# Altium project DM2097_R0M0E0.PrjPcb (part 4 of 4)
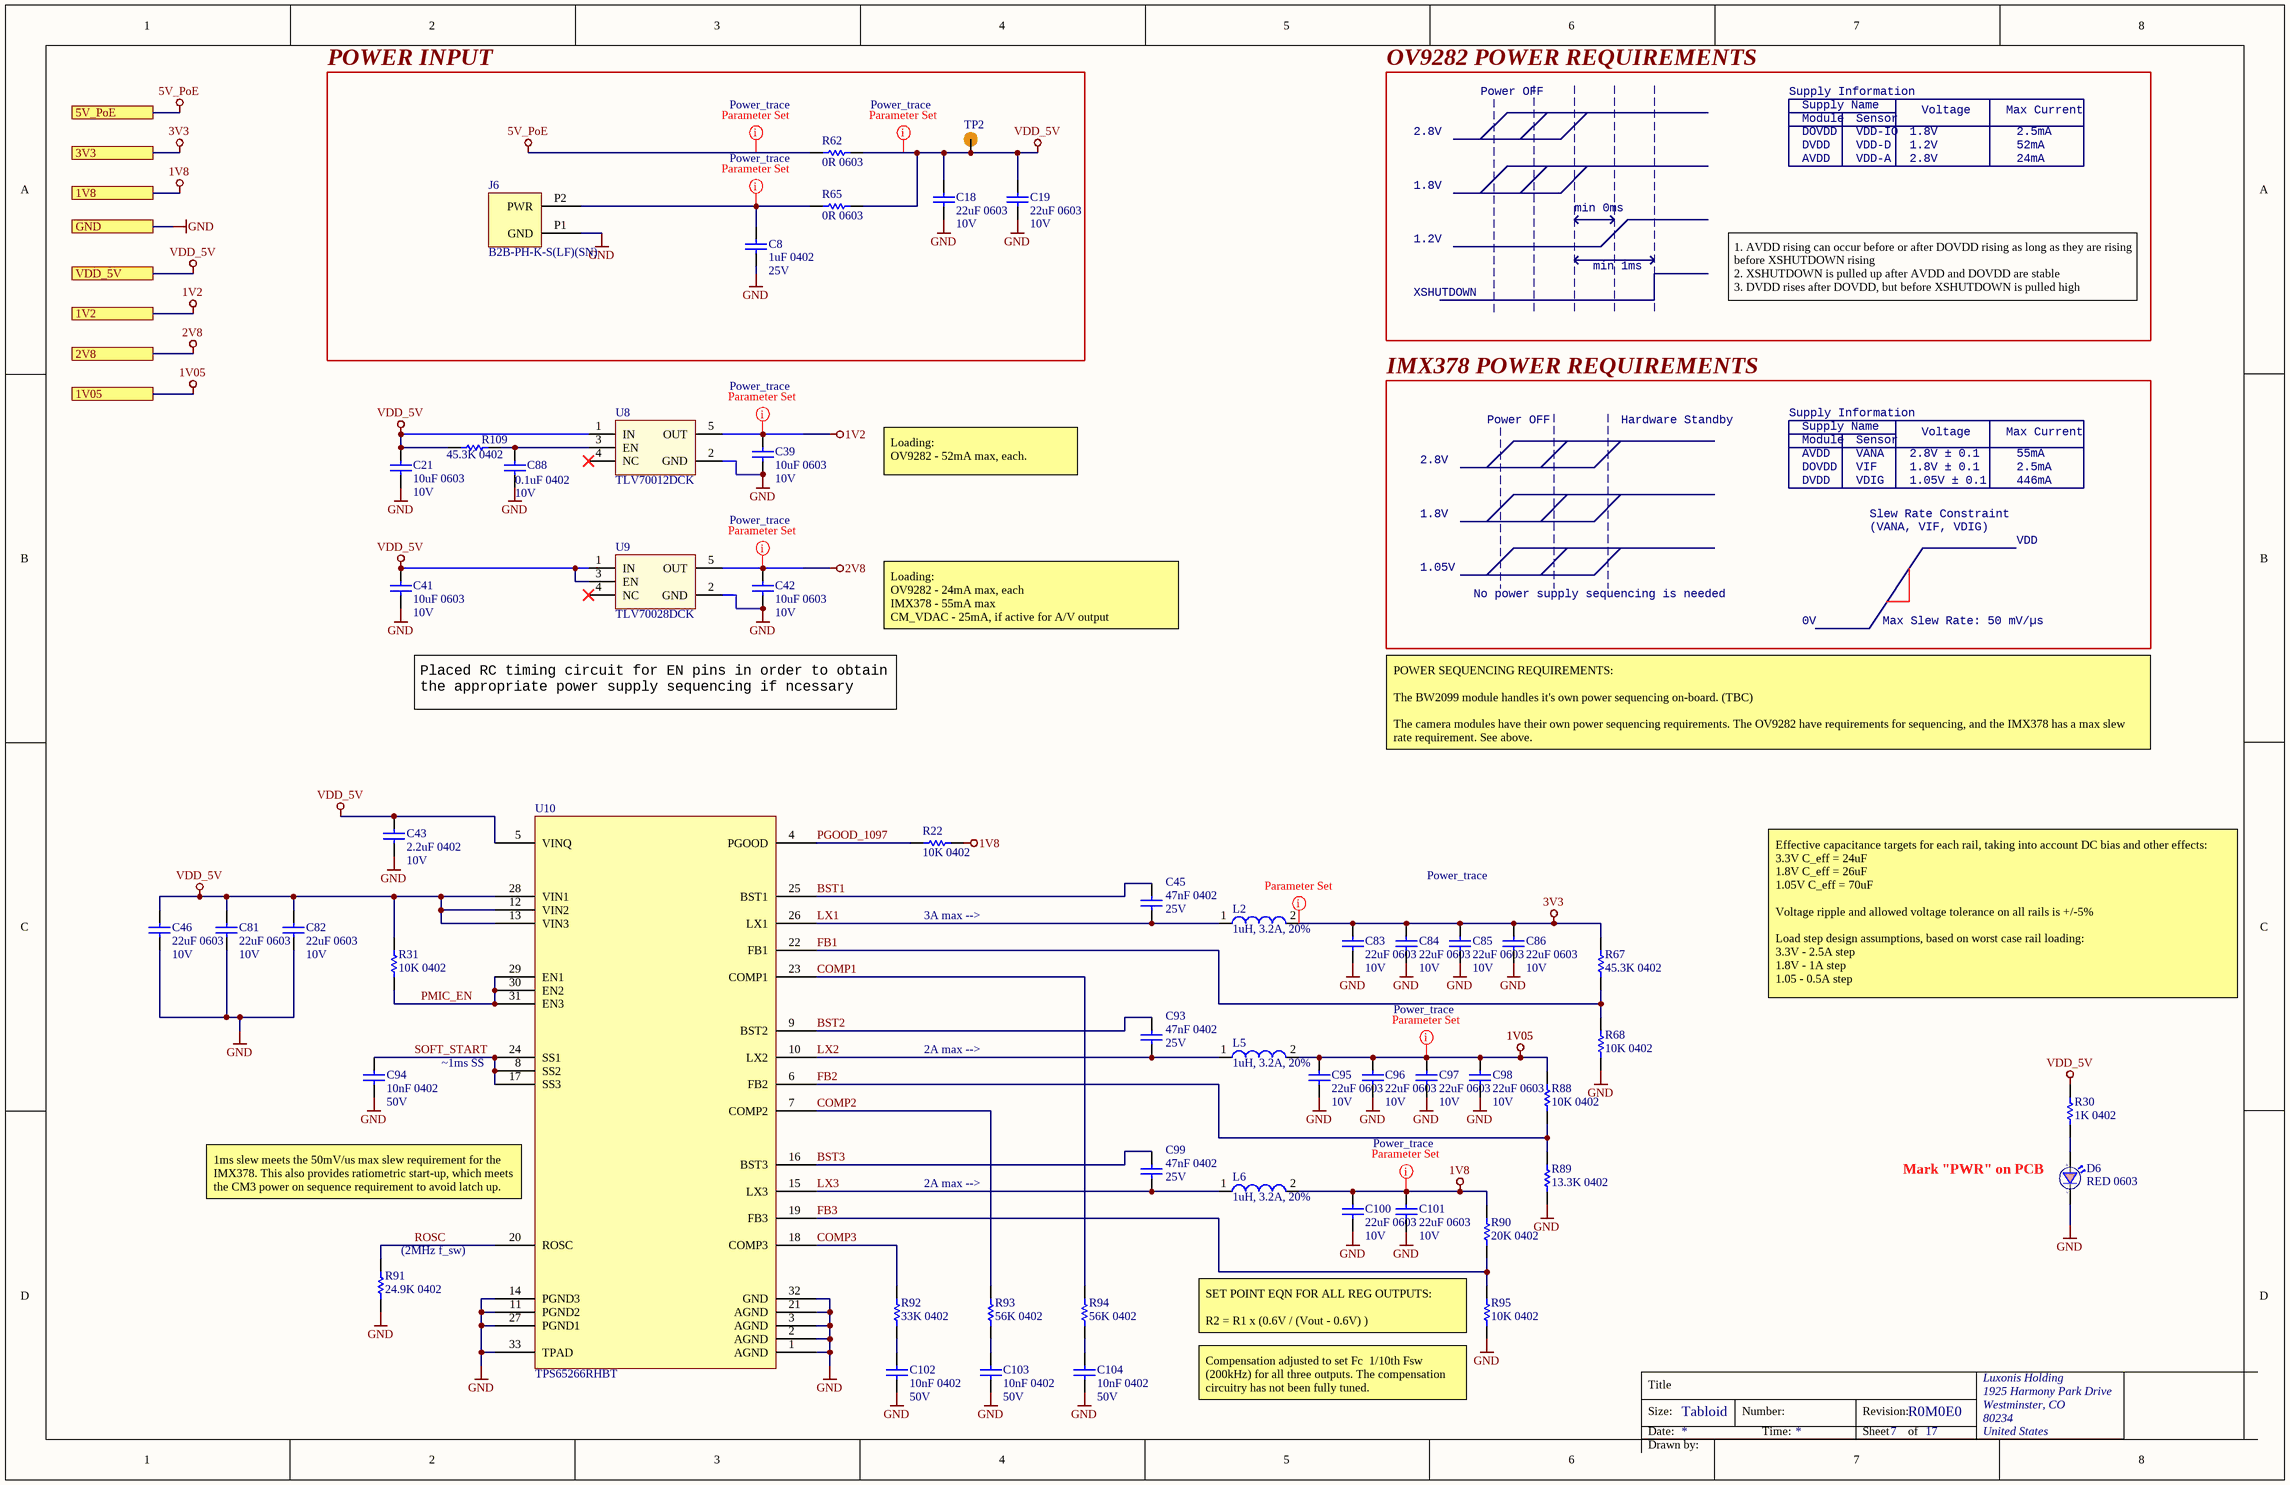
[diagram p9: DM2097_Power_Supply.SchDoc]

## Sheet DM2097_Power_Supply.SchDoc: =project_title (continued)

### Library data of the parts (continued)
U9 = TLV70028DCK: IC REG LINEAR 2.8V 200MA SC70-5 Linear Voltage Regulator IC  1 Output  200mA SC-70-5; Manufacturer 1: Texas Instruments; Manufacturer Part Number 1: TLV70028DCKT; Dropout Voltage: 175mV; Number of Outputs: 1; Max Power Dissipation: 320mW; Max Input Voltage: 5.5V; Min Input Voltage: 2V; Min Current Limit: 220mA; Polarity: Positive; Quiescent Current: 30uA; Accuracy: 2%; Output Type: Fixed; Nominal Supply Current: 31uA; Supplier 1: Digi-Key; Stock 1: 832; Pricing 1: 1=0.55000, 10=0.46700, 100=0.34900 (USD); RoHS: Yes; Case/Package: SC; Number of Pins: 5; Contact Plating: Gold; Min Operating Temperature: -40°C; Max Operating Temperature: 125°C; Package Quantity: 1; Packaging: Tape and Reel; Output Current: 200mA; Output Voltage: 2.8V; Max Output Current: 200mA; Number of Regulators: 1; Power Dissipation: 320mW; Min Output Voltage: 2.8V; Output Voltage Accuracy: 2%; Max Output Voltage: 2.8V; Max Supply Voltage: 5.5V; Min Supply Voltage: 2V; Nominal Output Voltage: 2.8V; Power Rating: 320mW; Termination: SMD/SMT; Length: 2.15mm; Height: 1mm; Width: 1.4mm; Radiation Hardening: No; Lead Free: Lead Free; REACH SVHC: No SVHC; ComponentLink1URL: https://datasheet.ciiva.com/14149/tlv700-eng-ds-14149840.pdf?src-supplier=Distrelec; ComponentLink1Description: https://datasheet.ciiva.com/14149/tlv700-eng-ds-14149840.pdf?src-supplier=Distrelec; ComponentLink2URL: https://datasheet.ciiva.com/22700/1882059-22700172.pdf?src-supplier=Element14; ComponentLink2Description: https://datasheet.ciiva.com/22700/1882059-22700172.pdf?src-supplier=Element14; Supplier 2: Digi-Key; Manufacturer 2: Texas Instruments; Manufacturer Part Number 2: TLV70028DCKR; Stock 2: 30013; Pricing 2: 1=0.48000, 10=0.40900, 100=0.30570, 500=0.24020, 1000=0.18561 (USD); ComponentLink3URL: http://components.arrow.com/part/dataview/0323_00585634?src-supplier=Arrow+Europe; ComponentLink3Description: http://components.arrow.com/part/dataview/0323_00585634?src-supplier=Arrow+Europe; ComponentLink4URL: http://focus.ti.com/lit/ds/symlink/tlv70033.pdf?src-supplier=Avnet+Europe; ComponentLink4Description: http://focus.ti.com/lit/ds/symlink/tlv70033.pdf?src-supplier=Avnet+Europe; ComponentLink5URL: http://www.ti.com/lit/ds/slvsa00d/slvsa00d.pdf?src-supplier=Digi-Key; ComponentLink5Description: http://www.ti.com/lit/ds/slvsa00d/slvsa00d.pdf?src-supplier=Digi-Key; ComponentLink6URL: http://www.ti.com/lit/pdf/slyy050?src-supplier=Digi-Key; ComponentLink6Description: http://www.ti.com/lit/pdf/slyy050?src-supplier=Digi-Key; ComponentLink7URL: http://www.ti.com/general/docs/lit/getliterature.tsp?genericPartNumber=TLV700&&fileType=pdf&src-supplier=Avnet+Asia; ComponentLink7Description: http://www.ti.com/general/docs/lit/getliterature.tsp?genericPartNumber=TLV700&&fileType=pdf&src-supplier=Avnet+Asia; ComponentLink8URL: http://www.ti.com/general/docs/lit/getliterature.tsp?genericPartNumber=TLV700&&fileType=pdf&src-supplier=Avnet; ComponentLink8Description: http://www.ti.com/general/docs/lit/getliterature.tsp?genericPartNumber=TLV700&&fileType=pdf&src-supplier=Avnet; ComponentLink9URL: http://components.arrow.com/part/dataview/48329233S8322732N7713?src-supplier=Arrow; ComponentLink9Description: http://components.arrow.com/part/dataview/48329233S8322732N7713?src-supplier=Arrow; ComponentLink10URL: http://www.ti.com/litv/slvsa00d?src-supplier=Mouser; ComponentLink10Description: http://www.ti.com/litv/slvsa00d?src-supplier=Mouser; ComponentLink11URL: http://www.ti.com/lit/ds/slvsa00e/slvsa00e.pdf?src-supplier=Digi-Key; ComponentLink11Description: http://www.ti.com/lit/ds/slvsa00e/slvsa00e.pdf?src-supplier=Digi-Key; Supplier Part Number 1: 296-39279-1-ND; Supplier Part Number 2: 296-25271-1-ND
U10 = TPS65266RHBT: 2.7V to 6.5V Input, 3A/2A/2A Triple Buck Converter 32-VQFN -40 to 85; Manufacturer 1: Texas Instruments; Output Current: 2A; Switching Frequency: 2.4MHz; Number of Outputs: 3; Min Output Voltage: 600mV; Synchronous Rectifier: Yes; Quiescent Current: 340uA; Output Type: Adjustable; Output Configuration: Positive; Current - Output 1: 3A; Manufacturer Part Number 1: TPS65266RHBT; Package: 32-VQFN; Supplier 1: Digi-Key; Stock 1: 4557; Pricing 1: 1=4.01000, 10=3.59900, 100=2.94850 (USD); RoHS: Yes; Mount: Surface Mount; Case/Package: VQFN; Number of Pins: 32; Weight: 0.002547oz; Min Operating Temperature: -40°C; Max Operating Temperature: 85°C; Packaging: Tape and Reel; Package Quantity: 250; Min Input Voltage: 2.7V; Max Input Voltage: 6.5V; Max Output Voltage: 6.5V; Operating Supply Voltage: 6.5V; Current - Output 2: 2A; Lead Free: Lead Free; REACH SVHC: No SVHC; ComponentLink1URL: http://www.ti.com/general/docs/lit/getliterature.tsp?genericPartNumber=TPS65266&&fileType=pdf&src-supplier=Element14; ComponentLink1Description: http://www.ti.com/general/docs/lit/getliterature.tsp?genericPartNumber=TPS65266&&fileType=pdf&src-supplier=Element14; ComponentLink2URL: http://www.ti.com/general/docs/lit/getliterature.tsp?genericPartNumber=TPS65266&amp;&amp;fileType=pdf&src-supplier=Farnell; ComponentLink2Description: http://www.ti.com/general/docs/lit/getliterature.tsp?genericPartNumber=TPS65266&amp;&amp;fileType=pdf&src-supplier=Farnell; ComponentLink3URL: http://www.ti.com/general/docs/lit/getliterature.tsp?genericPartNumber=TPS65266&&fileType=pdf&src-supplier=Farnell; ComponentLink3Description: http://www.ti.com/general/docs/lit/getliterature.tsp?genericPartNumber=TPS65266&&fileType=pdf&src-supplier=Farnell; ComponentLink4URL: http://www.ti.com/lit/ds/symlink/tps65266.pdf?src-supplier=Digi-Key; ComponentLink4Description: http://www.ti.com/lit/ds/symlink/tps65266.pdf?src-supplier=Digi-Key; ComponentLink5URL: http://www.ti.com/lit/gpn/tps65266?src-supplier=Mouser; ComponentLink5Description: http://www.ti.com/lit/gpn/tps65266?src-supplier=Mouser; ComponentLink6URL: http://www.ti.com/general/docs/lit/getliterature.tsp?genericPartNumber=TPS65266&&fileType=pdf&src-supplier=Avnet; ComponentLink6Description: http://www.ti.com/general/docs/lit/getliterature.tsp?genericPartNumber=TPS65266&&fileType=pdf&src-supplier=Avnet; Supplier Part Number 1: 296-38685-1-ND; Supplier 2: TI store; Supplier 3: Mouser; Supplier Part Number 2: TPS65266RHBT; Supplier Part Number 3: 595-TPS65266RHBT; Supplier 4: Mouser; Manufacturer Part Number 2: TPS65266RHBR; Category: Voltage Regulators - Switching; Stock 4: 5792; Pricing 4: 1=3,58000, 10=3,22000, 50=3,05000, 100=2,51000, 1000=1,80000, 10000=1,73000 (USD); Contact Plating: Gold; Length: 5mm; Width: 5mm; Height: 1mm; RoHS Compliant: Yes; ComponentLink7URL: http://www.ti.com/general/docs/suppproductinfo.tsp?distId=10&amp;gotoUrl=http%3A%2F%2Fwww.ti.com%2Flit%2Fgpn%2Ftps65266&src-supplier=Digi-Key; ComponentLink7Description: http://www.ti.com/general/docs/suppproductinfo.tsp?distId=10&amp;gotoUrl=http%3A%2F%2Fwww.ti.com%2Flit%2Fgpn%2Ftps65266&src-supplier=Digi-Key; ComponentLink8URL: http://www.ti.com/general/docs/lit/getliterature.tsp?genericPartNumber=TPS65266&&fileType=pdf&src-supplier=Avnet+Asia; ComponentLink8Description: http://www.ti.com/general/docs/lit/getliterature.tsp?genericPartNumber=TPS65266&&fileType=pdf&src-supplier=Avnet+Asia; Manufacturer 2: Texas Instruments; Supplier 5: Mouser; Manufacturer 3: Texas Instruments; Manufacturer Part Number 3: TPS65266-1RHBR; Stock 5: 2820; Pricing 5: 1=3,58000, 10=3,22000, 50=3,05000, 100=2,51000, 1000=1,80000, 10000=1,73000 (USD); ComponentLink9URL: http://www.ti.com/lit/ds/symlink/tps65266-1.pdf?src-supplier=Digi-Key; ComponentLink9Description: http://www.ti.com/lit/ds/symlink/tps65266-1.pdf?src-supplier=Digi-Key; Supplier Part Number 4: 595-TPS65266RHBR; Supplier Part Number 5: 595-TPS65266-1RHBR

## Sheet Project_Information.SchDoc: =project_title
size Tabloid; CompanyName: Luxonis Holding; DrawnBy: David Malovrh; Organization: Luxonis Holding; Address1: 1925 Harmony Park Drive; Address2: Westminster, CO; Address3: 80234; Address4: United States; DocumentNumber: D0000200; Revision: R0M0E0; SheetNumber: 1; SheetTotal: 17
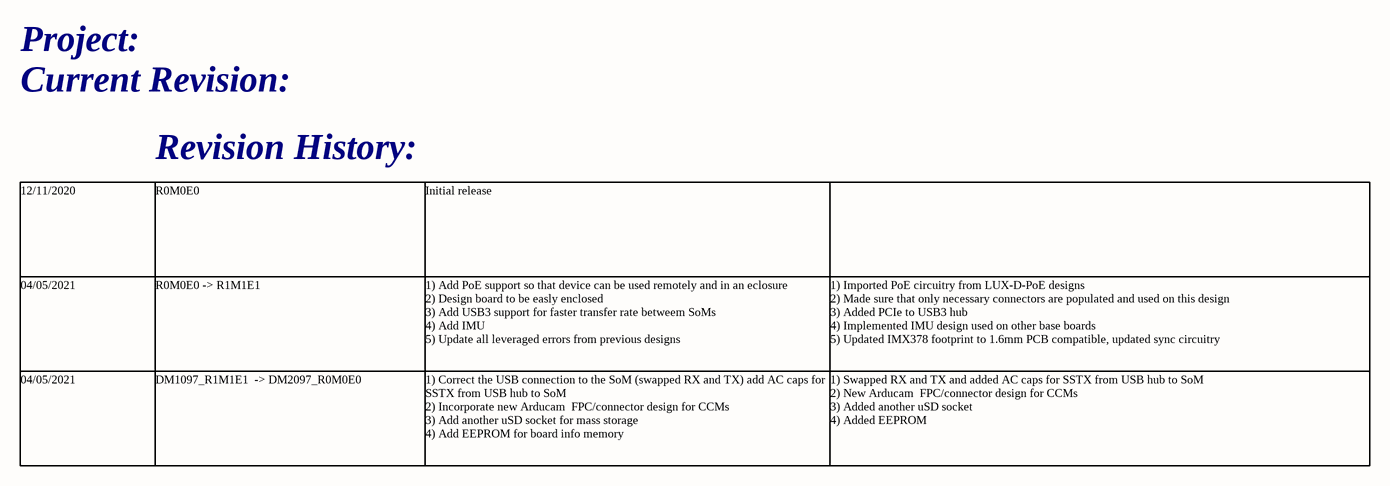
[diagram p5: Project_Information.SchDoc]

### Notes on the sheet
- Project:
- Current Revision:
- Revision History:
- 12/11/2020
- R0M0E0
- Initial release
- 04/05/2021
- R0M0E0 -> R1M1E1
- 1) Add PoE support so that device can be used remotely and in an eclosure
  2) Design board to be easly enclosed
  3) Add USB3 support for faster transfer rate betweem SoMs
  4) Add IMU
  5) Update all leveraged errors from previous designs
- 1) Imported PoE circuitry from LUX-D-PoE designs
  2) Made sure that only necessary connectors are populated and used on this design
  3) Added PCIe to USB3 hub
  4) Implemented IMU design used on other base boards
  5) Updated IMX378 footprint to 1.6mm PCB compatible, updated sync circuitry
- DM1097_R1M1E1  -> DM2097_R0M0E0
- 1) Correct the USB connection to the SoM (swapped RX and TX) add AC caps for SSTX from USB hub to SoM
  2) Incorporate new Arducam  FPC/connector design for CCMs
  3) Add another uSD socket for mass storage
  4) Add EEPROM for board info memory
- 1) Swapped RX and TX and added AC caps for SSTX from USB hub to SoM
  2) New Arducam  FPC/connector design for CCMs
  3) Added another uSD socket
  4) Added EEPROM
- Title
- Size:
- Date:
- Tabloid
- Number:
- Time:
- Revision:
- Sheet
- of
- Drawn by:

## Sheet DM2097_Connector_B.SchDoc: =project_title
size Tabloid; CompanyName: Luxonis Holding; DrawnBy: David Malovrh; Organization: Luxonis Holding; Address1: 1925 Harmony Park Drive; Address2: Westminster, CO; Address3: 80234; Address4: United States; DocumentNumber: D0000200; Revision: R0M0E0; SheetNumber: 3; SheetTotal: 17
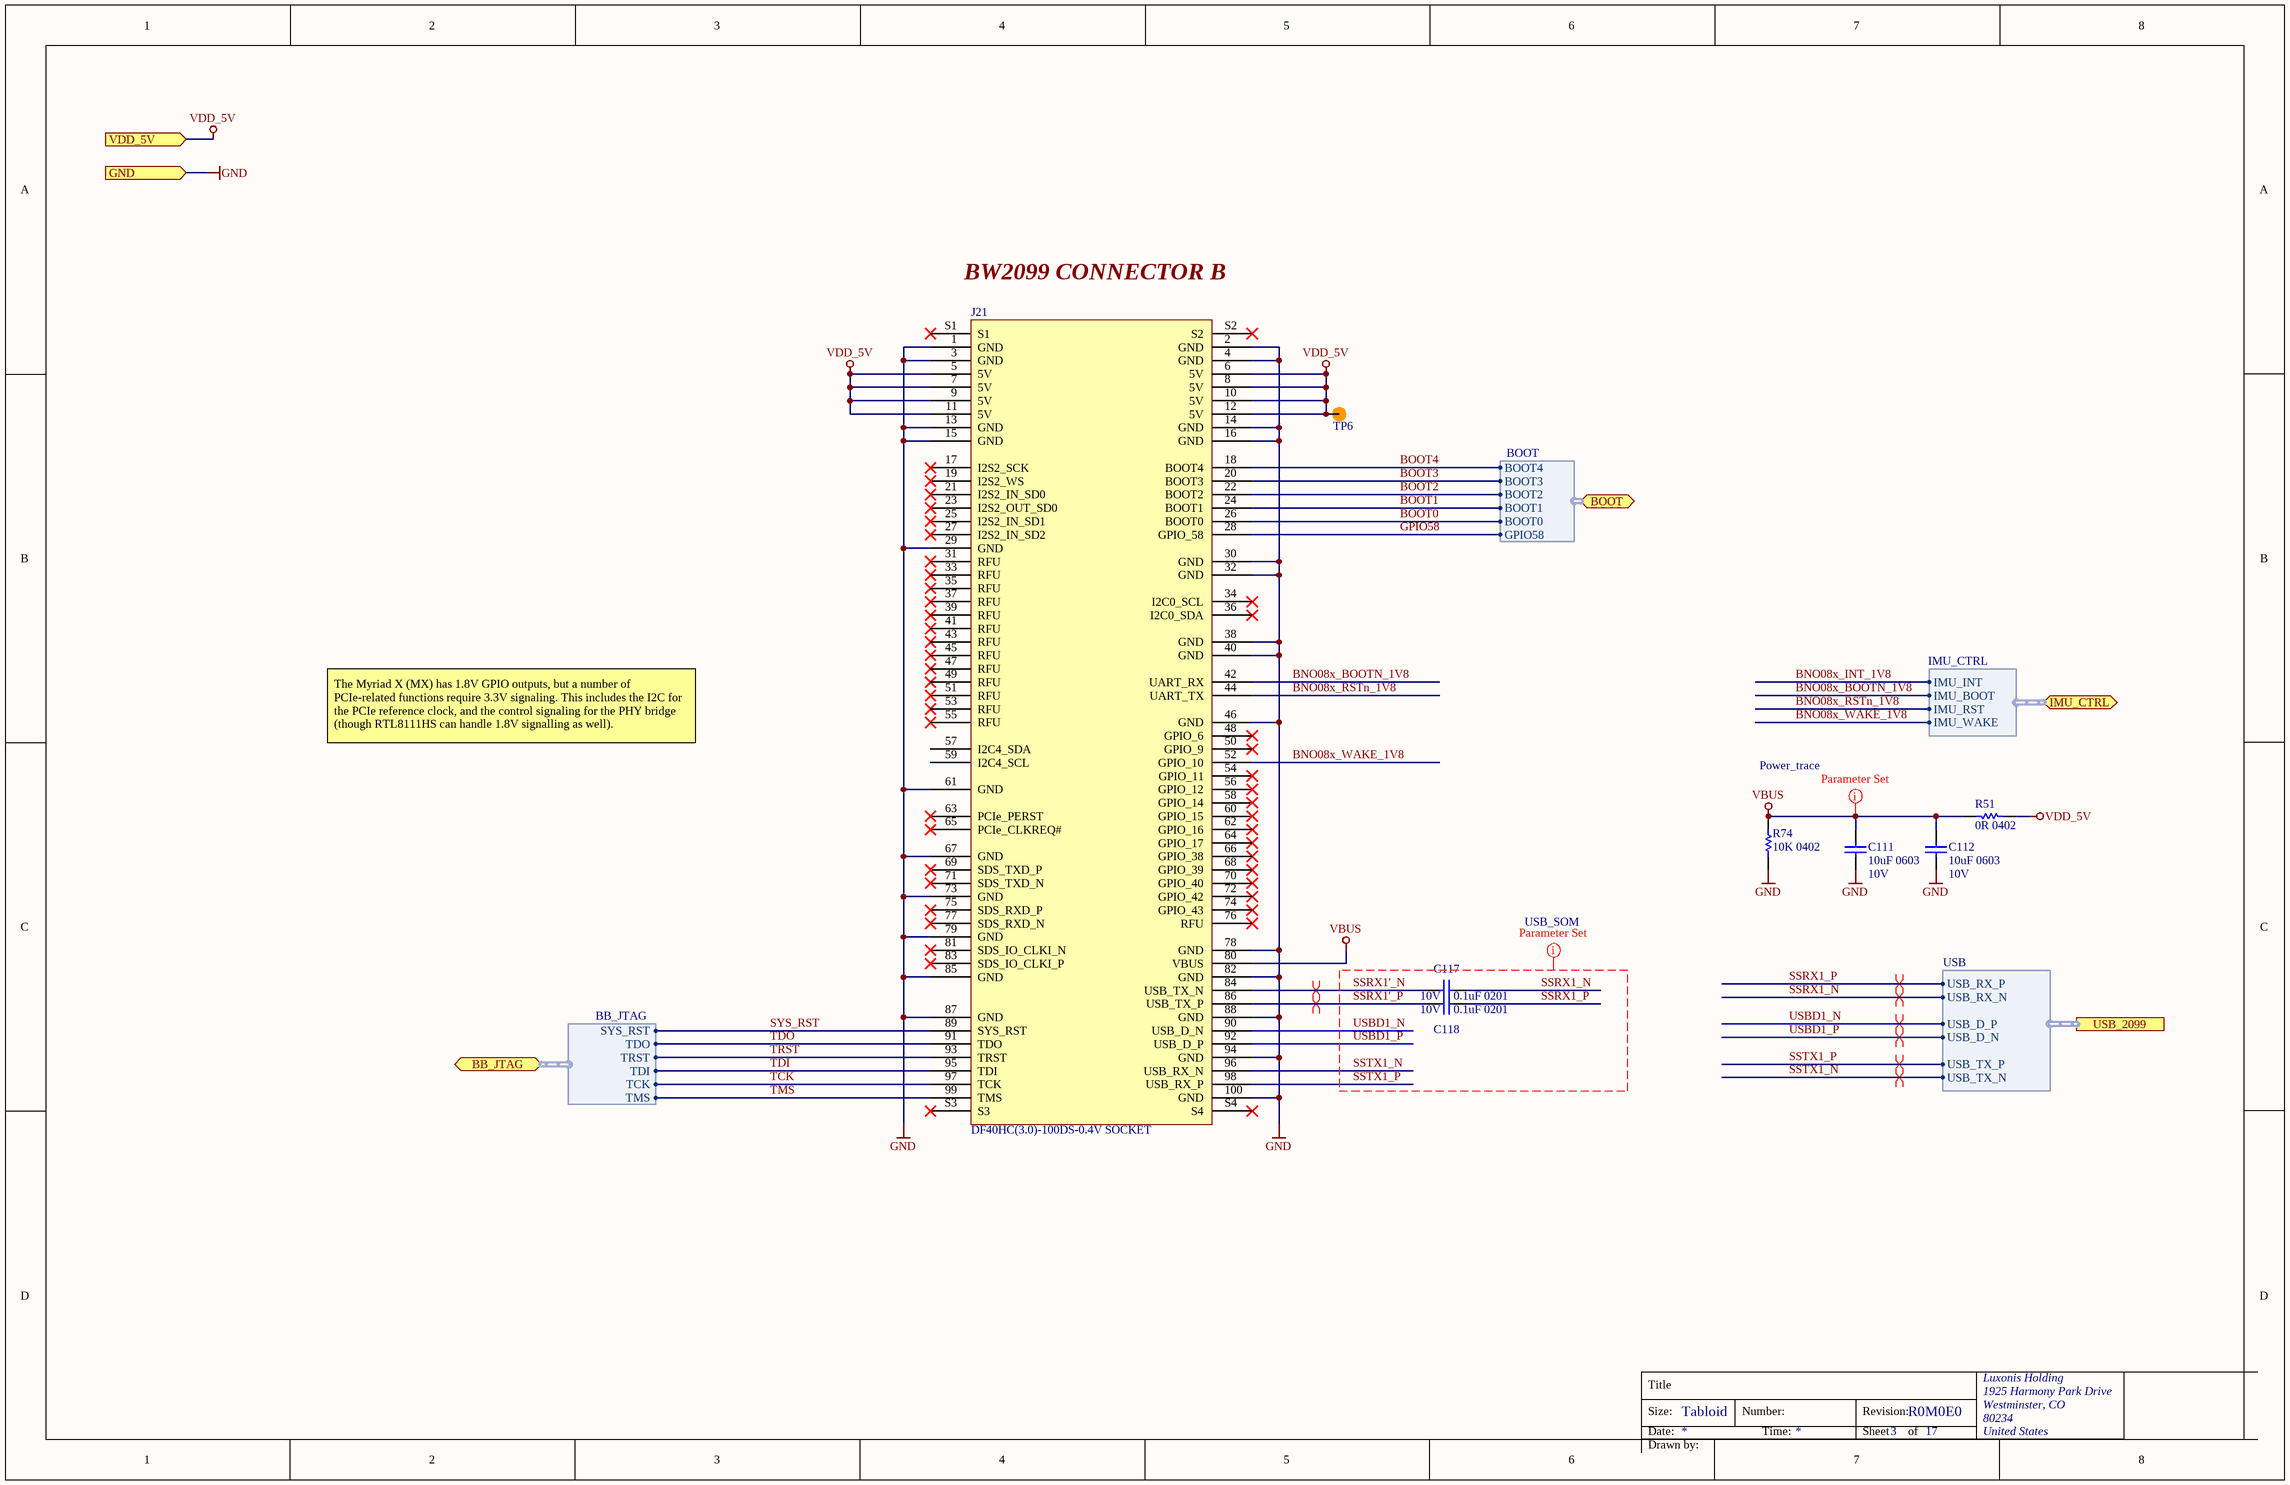
[diagram p6: DM2097_Connector_B.SchDoc]

### Parts
C111  10uF 0603  Voltage Rating: 10V  [CAPC0603(1608)100_N]
C112  10uF 0603  Voltage Rating: 10V  [CAPC0603(1608)100_N]
C117  0.1uF 0201  Voltage: 10V  [CAPC0201(0603)33_L]
C118  0.1uF 0201  Voltage: 10V  [CAPC0201(0603)33_L]
J21  DF40HC(3.0)-100DS-0.4V SOCKET  [DF40HC-3.0-100DS-0.4V_minpad]
R51  0R 0402  [RESC0402(1005)_N]
R74  10K 0402  [RESC0402(1005)_N]
TP6  TP100_200_NS  [TP100_200_NS]  (value not drawn)  (no BOM)

### Ports
BB_JTAG (bidir, harness BB_JTAG), BOOT (bidir, harness BOOT), GND (in), IMU_CTRL (bidir, harness IMU_CTRL), USB_2099 (harness USB), VDD_5V (in)

### Harnesses
BB_JTAG: SYS_RST, TDO, TRST, TDI, TCK, TMS
BOOT: BOOT4, BOOT3, BOOT2, BOOT1, BOOT0, GPIO58
USB: USB_D_P, USB_D_N, USB_TX_N, USB_TX_P, USB_RX_N, USB_RX_P
IMU_CTRL: IMU_BOOT, IMU_RST, IMU_INT, IMU_WAKE

### Nets
GND: C111.1 C112.1 J21.1(GND) J21.2(GND) J21.3(GND) J21.4(GND) J21.13(GND) J21.14(GND) J21.15(GND) J21.16(GND) J21.29(GND) J21.30(GND) J21.32(GND) J21.38(GND) J21.40(GND) J21.46(GND) J21.61(GND) J21.67(GND) J21.73(GND) J21.78(GND) J21.79(GND) J21.82(GND) J21.85(GND) J21.87(GND) J21.88(GND) J21.94(GND) J21.100(GND) R74.1 ; port GND
VBUS: C111.2 C112.2 J21.80(VBUS) R51.1 R74.2
VDD_5V: J21.5(5V) J21.6(5V) J21.7(5V) J21.8(5V) J21.9(5V) J21.10(5V) J21.11(5V) J21.12(5V) R51.2 TP6.1 ; port VDD_5V
BNO08x_BOOTN_1V8: J21.42(UART_RX) ; port IMU_CTRL.IMU_BOOT
BNO08x_RSTn_1V8: J21.44(UART_TX) ; port IMU_CTRL.IMU_RST
BNO08x_WAKE_1V8: J21.52(GPIO_10) ; port IMU_CTRL.IMU_WAKE
BOOT0: J21.26(BOOT0) ; port BOOT.BOOT0
BOOT1: J21.24(BOOT1) ; port BOOT.BOOT1
BOOT2: J21.22(BOOT2) ; port BOOT.BOOT2
BOOT3: J21.20(BOOT3) ; port BOOT.BOOT3
BOOT4: J21.18(BOOT4) ; port BOOT.BOOT4
GPIO58: J21.28(GPIO_58) ; port BOOT.GPIO58
SSRX1'_N: C117.1 J21.84(USB_TX_N)
SSRX1'_P: C118.1 J21.86(USB_TX_P)
SSRX1_N: C117.2 ; port USB_2099.USB_RX_N
SSRX1_P: C118.2 ; port USB_2099.USB_RX_P
SSTX1_N: J21.96(USB_RX_N) ; port USB_2099.USB_TX_N
SSTX1_P: J21.98(USB_RX_P) ; port USB_2099.USB_TX_P
SYS_RST: J21.89(SYS_RST) ; port BB_JTAG.SYS_RST
TCK: J21.97(TCK) ; port BB_JTAG.TCK
TDI: J21.95(TDI) ; port BB_JTAG.TDI
TDO: J21.91(TDO) ; port BB_JTAG.TDO
TMS: J21.99(TMS) ; port BB_JTAG.TMS
TRST: J21.93(TRST) ; port BB_JTAG.TRST
USBD1_N: J21.90(USB_D_N) ; port USB_2099.USB_D_P
USBD1_P: J21.92(USB_D_P) ; port USB_2099.USB_D_N

Not connected (* = marked no-connect by the designer): J21 17(I2S2_SCK)* 19(I2S2_WS)* 21(I2S2_IN_SD0)* 23(I2S2_OUT_SD0)* 25(I2S2_IN_SD1)* 27(I2S2_IN_SD2)* 31(RFU)* 33(RFU)* 34(I2C0_SCL)* 35(RFU)* 36(I2C0_SDA)* 37(RFU)* 39(RFU)* 41(RFU)* 43(RFU)* 45(RFU)* 47(RFU)* 48(GPIO_6)* 49(RFU)* 50(GPIO_9)* 51(RFU)* 53(RFU)* 54(GPIO_11)* 55(RFU)* 56(GPIO_12)* 57(I2C4_SDA) 58(GPIO_14)* 59(I2C4_SCL) 60(GPIO_15)* 62(GPIO_16)* 63(PCIe_PERST)* 64(GPIO_17)* 65(PCIe_CLKREQ#)* 66(GPIO_38)* 68(GPIO_39)* 69(SDS_TXD_P)* 70(GPIO_40)* 71(SDS_TXD_N)* 72(GPIO_42)* 74(GPIO_43)* 75(SDS_RXD_P)* 76(RFU)* 77(SDS_RXD_N)* 81(SDS_IO_CLKI_N)* 83(SDS_IO_CLKI_P)* S1* S2* S3* S4*

### Layout directives
differential pair; differential pair class 90ohm: SSRX1'_N, SSRX1'_P, SSRX1_N, SSRX1_P, SSTX1_N, SSTX1_P, USBD1_N, USBD1_P
net class Power_trace: VBUS
net class USB_SOM: SSRX1'_N, SSRX1'_P, SSRX1_N, SSRX1_P, SSTX1_N, SSTX1_P, USBD1_N, USBD1_P

### Notes on the sheet
- (near J21) BW2099 CONNECTOR B
- The Myriad X (MX) has 1.8V GPIO outputs, but a number of PCIe-related functions require 3.3V signaling. This includes the I2C for the PCIe reference clock, and the control signaling for the PHY bridge (though RTL8111HS can handle 1.8V signalling as well).
- Title
- Size:
- Date:
- Tabloid
- Number:
- Time:
- Revision:
- Sheet
- of
- Drawn by:

### Library data of the parts
C111 C112 = GRM188R61A106ME69D: CAP CER 10UF 10V X5R 0603 20%; Manufacturer 1: Murata; Material: Ceramic; Manufacturer Part Number 1: GRM188R61A106ME69D; Supplier 1: Digi-Key; Stock 1: 2873098; Pricing 1: 1=0.21000, 10=0.14100, 100=0.07130, 500=0.04876, 1000=0.04313 (USD); RoHS: Yes; Mount: Surface Mount; Case/Package: 0603; Case Code (Metric): 1608; Case Code (Imperial): 0603; Min Operating Temperature: -55°C; Max Operating Temperature: 85°C; Packaging: Tape and Reel; Capacitance: 10uF; Dielectric: X5R; Length: 1.6mm; Width: 0.8mm; ComponentLink1URL: http://www.mouser.com/ds/2/281/c02e-2905.pdf?src-supplier=Mouser; ComponentLink1Description: http://www.mouser.com/ds/2/281/c02e-2905.pdf?src-supplier=Mouser; Supplier Part Number 1: 490-10475-1-ND; Voltage Rating (DC): 10V; Thickness: 0.035inch; Tolerance: 20%; Weight: 0.000222oz; Package Quantity: 4000; Termination: SMD/SMT; Height: 0.8mm; Depth: 0.8mm; REACH SVHC: Unknown; Lead Free: Lead Free; ComponentLink2URL: http://components.arrow.com/part/dataview/0323_06119472?src-supplier=Arrow+Europe; ComponentLink2Description: http://components.arrow.com/part/dataview/0323_06119472?src-supplier=Arrow+Europe; ComponentLink3URL: http://www.farnell.com/datasheets/2048014.pdf?src-supplier=Farnell; ComponentLink3Description: http://www.farnell.com/datasheets/2048014.pdf?src-supplier=Farnell; ComponentLink4URL: http://www.farnell.com/datasheets/1872210.pdf?src-supplier=Farnell; ComponentLink4Description: http://www.farnell.com/datasheets/1872210.pdf?src-supplier=Farnell; ComponentLink5URL: http://search.murata.co.jp/Ceramy/image/img/A01X/G101/ENG/GRM188R61A106ME69-01.pdf?src-supplier=Digi-Key; ComponentLink5Description: http://search.murata.co.jp/Ceramy/image/img/A01X/G101/ENG/GRM188R61A106ME69-01.pdf?src-supplier=Digi-Key; ComponentLink6URL: http://www.farnell.com/datasheets/1872210.pdf?src-supplier=Newark; ComponentLink6Description: http://www.farnell.com/datasheets/1872210.pdf?src-supplier=Newark; ComponentLink7URL: http://www.farnell.com/datasheets/2048014.pdf?src-supplier=Element14; ComponentLink7Description: http://www.farnell.com/datasheets/2048014.pdf?src-supplier=Element14; ComponentLink8URL: http://www.farnell.com/datasheets/2048014.pdf?src-supplier=Newark; ComponentLink8Description: http://www.farnell.com/datasheets/2048014.pdf?src-supplier=Newark
C117 C118 = GRM033R61A104KE15D: CAP CER 0.1UF 10V X5R 0201; Manufacturer 1: Murata; Capacitance: 100nF; Tolerance: 10%; Supplier 1: Digi-Key; Manufacturer Part Number 1: GRM033R61A104KE15D; Stock 1: 45335312; Pricing 1: 1=0.10000, 10=0.04200, 100=0.01860, 500=0.01330, 1000=0.01045, 2500=0.00950, 5000=0.00874 (USD); RoHS: Yes; Mount: Surface Mount; Case/Package: 0201; Weight: 6E-06oz; Case Code (Metric): 0603; Case Code (Imperial): 0201; Min Operating Temperature: -55°C; Max Operating Temperature: 85°C; Packaging: Tape and Reel; Voltage Rating: 10V; Package Quantity: 1; Voltage Rating (DC): 10V; Dielectric: X5R; Termination: SMD/SMT; Length: 0.6mm; Height: 0.3mm; Width: 0.012inch; Thickness: 0.013inch; Depth: 0.3mm; Radiation Hardening: No; Lead Free: Lead Free; REACH SVHC: No SVHC; ComponentLink1URL: https://datasheet.ciiva.com/26843/getdatasheetpartid-308656-26843739.pdf?src-supplier=Verical; ComponentLink1Description: https://datasheet.ciiva.com/26843/getdatasheetpartid-308656-26843739.pdf?src-supplier=Verical; ComponentLink2URL: https://datasheet.ciiva.com/5413/product-5413117.pdf?src-supplier=Mouser; ComponentLink2Description: https://datasheet.ciiva.com/5413/product-5413117.pdf?src-supplier=Mouser; ComponentLink3URL: https://datasheet.ciiva.com/6256/partnumbering-e-01-6256406.pdf?src-supplier=Digi-Key; ComponentLink3Description: https://datasheet.ciiva.com/6256/partnumbering-e-01-6256406.pdf?src-supplier=Digi-Key; ComponentLink4URL: https://datasheet.ciiva.com/6256/partnumbering-e-01-6256407.pdf?src-supplier=Digi-Key; ComponentLink4Description: https://datasheet.ciiva.com/6256/partnumbering-e-01-6256407.pdf?src-supplier=Digi-Key; ComponentLink5URL: https://datasheet.ciiva.com/6256/partnumbering-e-01-6256408.pdf?src-supplier=Digi-Key; ComponentLink5Description: https://datasheet.ciiva.com/6256/partnumbering-e-01-6256408.pdf?src-supplier=Digi-Key; Supplier Part Number 1: 490-5881-1-ND
J21 = BW2099_SCKT_Conn_B: Conn Board to Board RCP 100 POS 0.4mm Solder ST SMD T/R; Manufacturer 1: Hirose; Manufacturer Part Number 1: DF40HC(3.0)-100DS-0.4V(51; Connector Type: Receptacle; Number of Positions: 100; Pitch: 0.016inch; Supplier 1: Mouser; RoHS: Yes; Category: Headers and Wire Housings; Stock 1: 4724; Pricing 1: 1=2.50000, 10=2.15000, 50=2.15000, 100=2.00000, 1000=1.45000, 10000=1.29000 (USD); Mount: Surface Mount; Contact Plating: Gold; Package Quantity: 3000; Packaging: Tape and Reel; Number of Rows: 2; ComponentLink1URL: https://datasheet.ciiva.com/13559/ed-df40-20140305-13559540.pdf?src-supplier=Mouser; ComponentLink1Description: https://datasheet.ciiva.com/13559/ed-df40-20140305-13559540.pdf?src-supplier=Mouser; ComponentLink2URL: https://datasheet.ciiva.com/18562/ed-df40-20140305-18562462.pdf?src-supplier=Digi-Key; ComponentLink2Description: https://datasheet.ciiva.com/18562/ed-df40-20140305-18562462.pdf?src-supplier=Digi-Key
R51 = CRCW04020000Z0ED: RES SMD 0 OHM JUMPER 1/16W 0402; Manufacturer 1: Vishay; Resistance: 0mR; Power Rating: 63mW; Voltage Rating: 50V; Temperature Coefficient: 100ppm/°C; Tolerance: 5%; Manufacturer Part Number 1: CRCW04020000Z0ED; Supplier 1: Digi-Key; Stock 1: 855968; Pricing 1: 1=0.10000, 10=0.03400, 25=0.02440, 50=0.01860, 100=0.01380, 250=0.01048, 500=0.00840, 1000=0.00618, 5000=0.00443 (USD); RoHS: Yes; Mount: Surface Mount; Case/Package: 0402; Weight: 2.3E-05oz; Case Code (Imperial): 0402; Case Code (Metric): 1005; Contact Plating: Tin; Min Operating Temperature: -55°C; Max Operating Temperature: 155°C; Packaging: Tape and Reel; Composition: Thick Film; Voltage Rating (DC): 50V; Package Quantity: 1; Termination: SMD/SMT; Number of Terminations: 2; Military Standard: Not; Max Power Dissipation: 63mW; Features: Automotive AEC-Q200; Length: 1mm; Height: 0.35mm; Width: 0.5mm; Depth: 0.5mm; Radiation Hardening: No; REACH SVHC: Unknown; Lead Free: Lead Free; ComponentLink1URL: https://datasheet.ciiva.com/3255/dcrcwe3-3255944.pdf?src-supplier=Avnet; ComponentLink1Description: https://datasheet.ciiva.com/3255/dcrcwe3-3255944.pdf?src-supplier=Avnet; ComponentLink2URL: https://datasheet.ciiva.com/3255/dcrcwe3-3255945.pdf?src-supplier=Avnet; ComponentLink2Description: https://datasheet.ciiva.com/3255/dcrcwe3-3255945.pdf?src-supplier=Avnet; ComponentLink3URL: https://datasheet.ciiva.com/16881/dcrcwe3-16881413.pdf?src-supplier=Avnet+Europe; ComponentLink3Description: https://datasheet.ciiva.com/16881/dcrcwe3-16881413.pdf?src-supplier=Avnet+Europe; ComponentLink4URL: https://datasheet.ciiva.com/2461/dcrcwe3-2461962.pdf?src-supplier=Digi-Key; ComponentLink4Description: https://datasheet.ciiva.com/2461/dcrcwe3-2461962.pdf?src-supplier=Digi-Key; ComponentLink5URL: https://datasheet.ciiva.com/7841/1720486-7841802.pdf?src-supplier=Element14; ComponentLink5Description: https://datasheet.ciiva.com/7841/1720486-7841802.pdf?src-supplier=Element14; ComponentLink6URL: https://datasheet.ciiva.com/2461/dcrcwe3-2461963.pdf?src-supplier=Digi-Key; ComponentLink6Description: https://datasheet.ciiva.com/2461/dcrcwe3-2461963.pdf?src-supplier=Digi-Key; ComponentLink7URL: https://datasheet.ciiva.com/2461/dcrcwe3-2461964.pdf?src-supplier=Digi-Key; ComponentLink7Description: https://datasheet.ciiva.com/2461/dcrcwe3-2461964.pdf?src-supplier=Digi-Key; ComponentLink8URL: https://datasheet.ciiva.com/7841/1697337-7841468.pdf?src-supplier=Element14; ComponentLink8Description: https://datasheet.ciiva.com/7841/1697337-7841468.pdf?src-supplier=Element14; ComponentLink9URL: https://datasheet.ciiva.com/16761/70200976-16761309.pdf?src-supplier=Allied+Electronics; ComponentLink9Description: https://datasheet.ciiva.com/16761/70200976-16761309.pdf?src-supplier=Allied+Electronics; ComponentLink10URL: https://datasheet.ciiva.com/26311/fld-crcw-e3-data-en-26311550.pdf?src-supplier=Distrelec; ComponentLink10Description: https://datasheet.ciiva.com/26311/fld-crcw-e3-data-en-26311550.pdf?src-supplier=Distrelec; Supplier Part Number 1: 541-0.0JCT-ND
R74 = RC0402FR-1310KL: RES SMD 10K OHM 1% 0402 1/16W Chip Resistor, 0402 [1005 Metric], 10 kohm, RC Series, 50 V, Thick Film, 62.5 mW; Manufacturer 1: Yageo; Resistance: 10kR; Temperature Coefficient: 100ppm/°C; Power Rating: 62.5mW; Voltage Rating: 50V; Manufacturer Part Number 1: RC0402FR-1310KL; ComponentLink1URL: https://datasheet.ciiva.com/16940/pyu-rc0402-51-rohs-l-6-16940293.pdf?src-supplier=Avnet+Europe; ComponentLink1Description: https://datasheet.ciiva.com/16940/pyu-rc0402-51-rohs-l-6-16940293.pdf?src-supplier=Avnet+Europe; ComponentLink2URL: https://datasheet.ciiva.com/28386/pyu-rc0402-51-rohs-l-6-28386855.pdf?src-supplier=Avnet+Europe; ComponentLink2Description: https://datasheet.ciiva.com/28386/pyu-rc0402-51-rohs-l-6-28386855.pdf?src-supplier=Avnet+Europe; ComponentLink3URL: https://datasheet.ciiva.com/16740/pyu-rc0402-51-rohs-l-6-r-16740602.pdf?src-supplier=Future+Electronics; ComponentLink3Description: https://datasheet.ciiva.com/16740/pyu-rc0402-51-rohs-l-6-r-16740602.pdf?src-supplier=Future+Electronics; ComponentLink4URL: https://datasheet.ciiva.com/8891/pyu-rc0402-51-rohs-l-6-8891339.pdf?src-supplier=Avnet; ComponentLink4Description: https://datasheet.ciiva.com/8891/pyu-rc0402-51-rohs-l-6-8891339.pdf?src-supplier=Avnet; ComponentLink5URL: https://datasheet.ciiva.com/5557/pyu-rc0402-51-rohs-l-6-r-5557997.pdf?src-supplier=Mouser; ComponentLink5Description: https://datasheet.ciiva.com/5557/pyu-rc0402-51-rohs-l-6-r-5557997.pdf?src-supplier=Mouser; ComponentLink6URL: https://datasheet.ciiva.com/7983/1018594-7983533.pdf?src-supplier=Element14; ComponentLink6Description: https://datasheet.ciiva.com/7983/1018594-7983533.pdf?src-supplier=Element14; Supplier 1: Newark; Stock 1: 62239; Pricing 1: 1=0.10000, 25=0.01200, 100=0.00400, 250=0.00400, 500=0.00300, 1000=0.00300 (USD); RoHS: Yes; Case/Package: 0402; Number of Pins: 2; Contact Plating: Tin,Matte,Lead; Case Code (Imperial): 0402; Case Code (Metric): 1005; Min Operating Temperature: -55°C; Max Operating Temperature: 155°C; Tolerance: 1%; Composition: Thick Film; Packaging: Tape and Reel; Termination: SMD/SMT; Military Standard: Not; Voltage Rating (DC): 50V; Working Voltage: 50V; Number of Terminations: 2; Length: 1mm; Depth: 0.5mm; Radiation Hardening: No; REACH SVHC: No SVHC; Lead Free: Lead Free; Supplier Part Number 1: 67R9960; Supplier 2: Future Electronics; Supplier 3: Mouser; Supplier 4: Element14; Supplier Part Number 2: RC0402FR-1310KL-CUTT; Supplier Part Number 3: 603-RC0402FR-1310KL; Supplier Part Number 4: 1799235
TP6 = TEST_POINT

## Sheet DM2097_IMU.SchDoc: =project_title
size Tabloid; CompanyName: Luxonis Holding; DrawnBy: David Malovrh; Organization: Luxonis Holding; Address1: 1925 Harmony Park Drive; Address2: Westminster, CO; Address3: 80234; Address4: United States; DocumentNumber: D0000200; Revision: R0M0E0; SheetNumber: 10; SheetTotal: 12
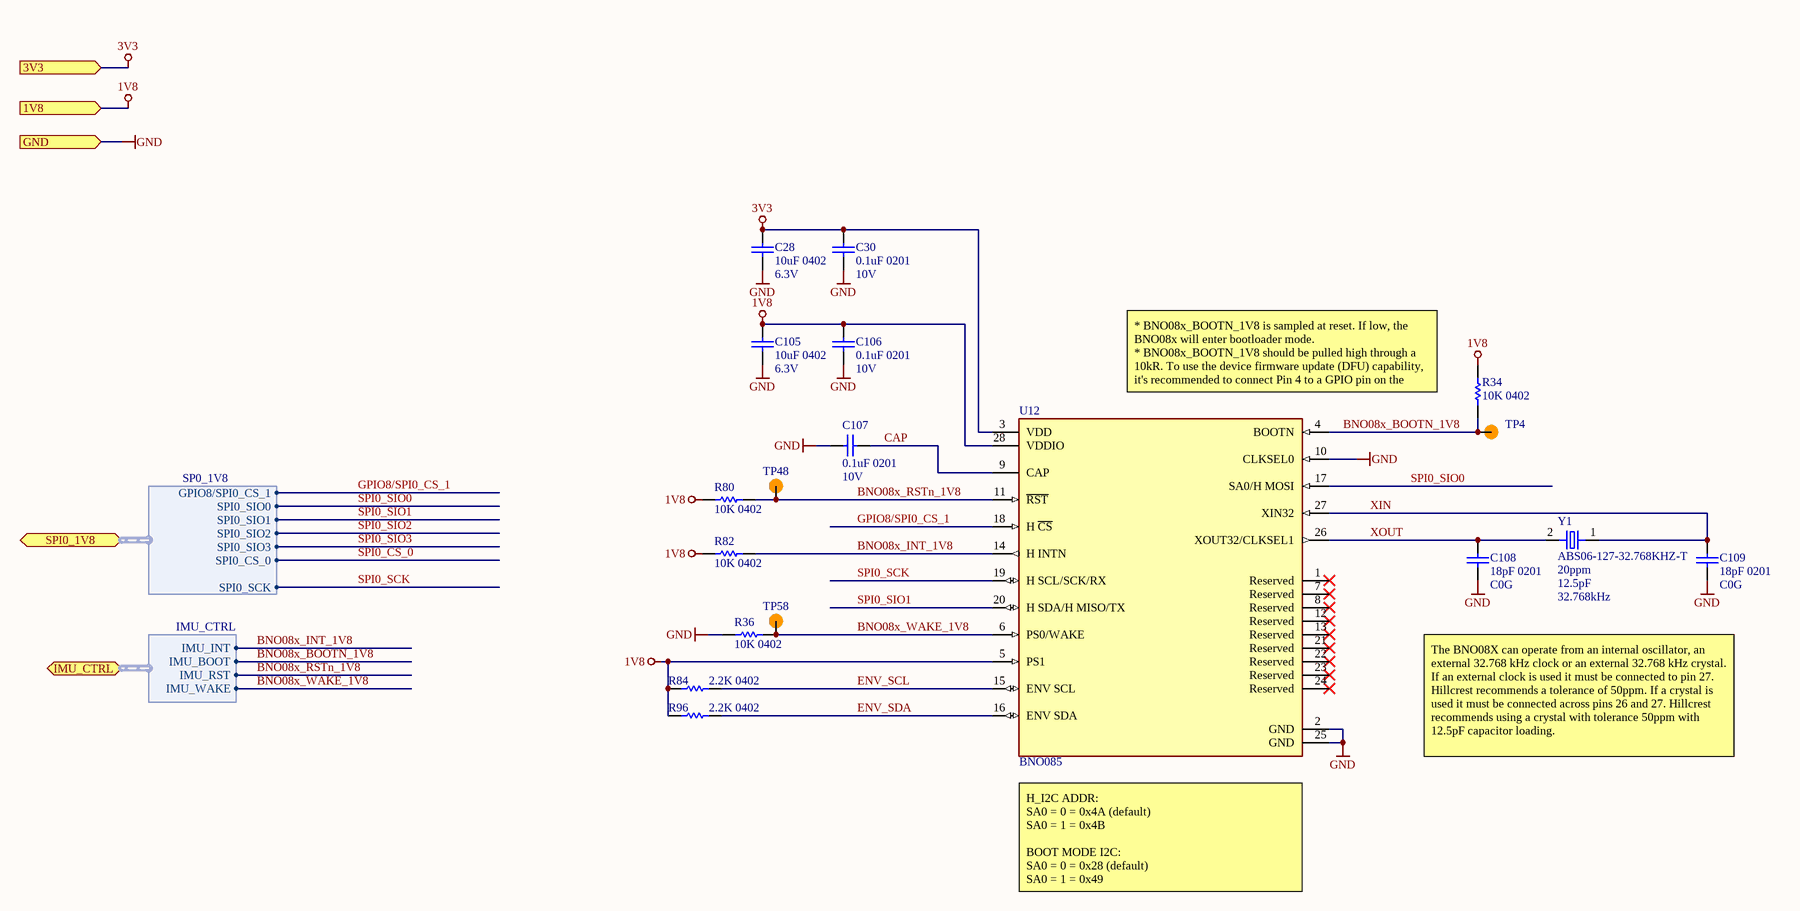
[diagram p7: DM2097_IMU.SchDoc]

### Parts
C28  10uF 0402  Voltage Rating: 6.3V  [CAPC0402(1005)70_L]
C30  0.1uF 0201  Voltage: 10V  [CAPC0201(0603)33_L]
C105  10uF 0402  Voltage Rating: 6.3V  [CAPC0402(1005)70_L]
C106  0.1uF 0201  Voltage: 10V  [CAPC0201(0603)33_L]
C107  0.1uF 0201  Voltage: 10V  [CAPC0201(0603)33_L]
C108  18pF 0201  Dielectric: C0G  [CAPC0201(0603)33_L]
C109  18pF 0201  Dielectric: C0G  [CAPC0201(0603)33_L]
R34  10K 0402  [RESC0402(1005)_L]
R36  10K 0402  [RESC0402(1005)_L]
R80  10K 0402  [RESC0402(1005)_L]
R82  10K 0402  [RESC0402(1005)_L]
R84  2.2K 0402  [RESC0402(1005)_L]
R96  2.2K 0402  [RESC0402(1005)_L]
TP4  TP100_200_NS  [TP100_200_NS]  (value not drawn)  (no BOM)
TP48  TP100_200_NS  [TP100_200_NS]  (value not drawn)  (no BOM)
TP58  TP100_200_NS  [TP100_200_NS]  (value not drawn)  (no BOM)
U12  BNO085  [BNO085]
Y1  ABS06-127-32.768KHZ-T  Frequency Tolerance: 20ppm  Load Capacitance: 12.5pF  Frequency: 32.768kHz  [ABS06-127-32.768KHZ-T]

### Ports
1V8 (in), 3V3 (in), GND (in), IMU_CTRL (bidir, harness IMU_CTRL), SPI0_1V8 (bidir, harness SP0_1V8)

### Harnesses
SP0_1V8: SPI0_SIO1, SPI0_SIO2, SPI0_SIO3, GPIO8/SPI0_CS_1, SPI0_SIO0, SPI0_CS_0, SPI0_SCK
IMU_CTRL: IMU_BOOT, IMU_RST, IMU_INT, IMU_WAKE

### Nets
1V8: C105.2 C106.2 R34.2 R80.2 R82.2 R84.1 R96.1 U12.5(PS1) U12.28(VDDIO) ; port 1V8
3V3: C28.2 C30.2 U12.3(VDD) ; port 3V3
GND: C28.1 C30.1 C105.1 C106.1 C107.2 C108.1 C109.1 R36.2 U12.2(GND) U12.10(CLKSEL0) U12.25(GND) ; port GND
BNO08x_BOOTN_1V8: R34.1 TP4.1 U12.4(BOOTN) ; port IMU_CTRL.IMU_BOOT
BNO08x_INT_1V8: R82.1 U12.14(H_INTN) ; port IMU_CTRL.IMU_INT
BNO08x_RSTn_1V8: R80.1 TP48.1 U12.11(~{RST}) ; port IMU_CTRL.IMU_RST
BNO08x_WAKE_1V8: R36.1 TP58.1 U12.6(PS0/WAKE) ; port IMU_CTRL.IMU_WAKE
CAP: C107.1 U12.9(CAP)
ENV_SCL: R84.2 U12.15(ENV_SCL)
ENV_SDA: R96.2 U12.16(ENV_SDA)
GPIO8/SPI0_CS_1: U12.18(H_~{CS}) ; port SPI0_1V8.GPIO8/SPI0_CS_1
SPI0_CS_0: port SPI0_1V8.SPI0_CS_0
SPI0_SCK: U12.19(H_SCL/SCK/RX) ; port SPI0_1V8.SPI0_SCK
SPI0_SIO0: U12.17(SA0/H_MOSI) ; port SPI0_1V8.SPI0_SIO0
SPI0_SIO1: U12.20(H_SDA/H_MISO/TX) ; port SPI0_1V8.SPI0_SIO1
SPI0_SIO2: port SPI0_1V8.SPI0_SIO2
SPI0_SIO3: port SPI0_1V8.SPI0_SIO3
XIN: C109.2 U12.27(XIN32) Y1.1
XOUT: C108.2 U12.26(XOUT32/CLKSEL1) Y1.2

Not connected (* = marked no-connect by the designer): U12 1(Reserved)* 7(Reserved)* 8(Reserved)* 12(Reserved)* 13(Reserved)* 21(Reserved)* 22(Reserved)* 23(Reserved)* 24(Reserved)*

### Notes on the sheet
- * BNO08x_BOOTN_1V8 is sampled at reset. If low, the BNO08x will enter bootloader mode.
  * BNO08x_BOOTN_1V8 should be pulled high through a 10kR. To use the device firmware update (DFU) capability, it's recommended to connect Pin 4 to a GPIO pin on the external uC.
- The BNO08X can operate from an internal oscillator, an external 32.768 kHz clock or an external 32.768 kHz crystal. If an external clock is used it must be connected to pin 27. Hillcrest recommends a tolerance of 50ppm. If a crystal is used it must be connected across pins 26 and 27. Hillcrest recommends using a crystal with tolerance 50ppm with 12.5pF capacitor loading.
- (near U12) H_I2C ADDR:
  SA0 = 0 = 0x4A (default)
  SA0 = 1 = 0x4B
  BOOT MODE I2C:
  SA0 = 0 = 0x28 (default)
  SA0 = 1 = 0x49
- Title
- Size:
- Date:
- Tabloid
- Number:
- Time:
- Revision:
- Sheet
- of
- Drawn by:

### Library data of the parts
C28 C105 = GRM155R60J106ME15D: CAP CER 10UF 6.3V X5R 0402 20%; Manufacturer 1: Murata; Supplier 1: Digi-Key; Manufacturer Part Number 1: GRM155R60J106ME15D; Stock 1: 1839627; Pricing 1: 1=0.23000, 10=0.15700, 100=0.07950, 500=0.05442, 1000=0.04814, 2500=0.04605, 5000=0.04186 (USD); RoHS: Yes; Mount: Surface Mount; Case/Package: 0402; Case Code (Metric): 1005; Case Code (Imperial): 0402; Min Operating Temperature: -55°C; Max Operating Temperature: 85°C; Packaging: Tape and Reel; Capacitance: 10uF; Dielectric: X5R; Length: 0.039inch; Width: 0.02inch; ComponentLink1URL: https://www.murata.com/~/media/webrenewal/support/library/catalog/products/capacitor/mlcc/c02e.ashx?la=en-us&src-supplier=Digi-Key; ComponentLink1Description: https://www.murata.com/~/media/webrenewal/support/library/catalog/products/capacitor/mlcc/c02e.ashx?la=en-us&src-supplier=Digi-Key; Supplier Part Number 1: 490-13238-1-ND; Voltage Rating (DC): 6.3V; Thickness: 0.026inch; Tolerance: 20%
C30 C106 C107 = GRM033R61A104KE15D: as C117 on sheet DM2097_Connector_B; Supplier 1: Digi-Key; Manufacturer Part Number 1: GRM033R61A104KE15D; Stock 1: 45335312; Pricing 1: 1=0.10000, 10=0.04200, 100=0.01860, 500=0.01330, 1000=0.01045, 2500=0.00950, 5000=0.00874 (USD); RoHS: Yes; Mount: Surface Mount; Case/Package: 0201; Weight: 6E-06oz; Case Code (Metric): 0603; Case Code (Imperial): 0201; Min Operating Temperature: -55°C; Max Operating Temperature: 85°C; Packaging: Tape and Reel; Voltage Rating: 10V; Package Quantity: 1; Voltage Rating (DC): 10V; Dielectric: X5R; Termination: SMD/SMT; Length: 0.6mm; Height: 0.3mm; Width: 0.012inch; Thickness: 0.013inch; Depth: 0.3mm; Radiation Hardening: No; Lead Free: Lead Free; REACH SVHC: No SVHC; ComponentLink1URL: https://datasheet.ciiva.com/26843/getdatasheetpartid-308656-26843739.pdf?src-supplier=Verical; ComponentLink1Description: https://datasheet.ciiva.com/26843/getdatasheetpartid-308656-26843739.pdf?src-supplier=Verical; ComponentLink2URL: https://datasheet.ciiva.com/5413/product-5413117.pdf?src-supplier=Mouser; ComponentLink2Description: https://datasheet.ciiva.com/5413/product-5413117.pdf?src-supplier=Mouser; ComponentLink3URL: https://datasheet.ciiva.com/6256/partnumbering-e-01-6256406.pdf?src-supplier=Digi-Key; ComponentLink3Description: https://datasheet.ciiva.com/6256/partnumbering-e-01-6256406.pdf?src-supplier=Digi-Key; ComponentLink4URL: https://datasheet.ciiva.com/6256/partnumbering-e-01-6256407.pdf?src-supplier=Digi-Key; ComponentLink4Description: https://datasheet.ciiva.com/6256/partnumbering-e-01-6256407.pdf?src-supplier=Digi-Key; ComponentLink5URL: https://datasheet.ciiva.com/6256/partnumbering-e-01-6256408.pdf?src-supplier=Digi-Key; ComponentLink5Description: https://datasheet.ciiva.com/6256/partnumbering-e-01-6256408.pdf?src-supplier=Digi-Key; Supplier Part Number 1: 490-5881-1-ND
C108 C109 = GRM0335C1E180FA01D: Cap Ceramic 18pF 25V C0G 1% Pad SMD 0201 125C T/R; Manufacturer 1: Murata; Supplier 1: Digi-Key; Manufacturer Part Number 1: GRM0335C1E180FA01D; RoHS: Yes; Category: Ceramic Capacitors; Stock 1: 27511; Pricing 1: 1=0.10000, 10=0.02100, 100=0.00930, 500=0.00666, 1000=0.00523, 2500=0.00476, 5000=0.00438 (USD); Mount: Surface Mount; Case/Package: 0201; Case Code (Imperial): 0201; Case Code (Metric): 0603; Min Operating Temperature: -55°C; Max Operating Temperature: 125°C; Capacitance: 18pF; Tolerance: 1%; Packaging: Tape and Reel; Voltage Rating (DC): 25V; Package Quantity: 15000; Voltage Rating: 25V; Termination: SMD/SMT; Length: 0.024inch; Height: 0.3mm; Thickness: 0.013inch; Width: 0.3mm; ComponentLink1URL: https://datasheet.ciiva.com/29538/partnumbering-e-01-29538328.pdf?src-supplier=Digi-Key; ComponentLink1Description: https://datasheet.ciiva.com/29538/partnumbering-e-01-29538328.pdf?src-supplier=Digi-Key; Supplier 2: Digi-Key; Supplier 3: Mouser; Supplier Part Number 3: 81-GRM0335C1E180FA1D; Supplier Part Number 2: 490-17804-2-ND; Supplier Part Number 1: 490-17804-1-ND
R34 R36 R80 R82 = RC0402FR-1310KL: as R74 on sheet DM2097_Connector_B; ComponentLink1URL: https://datasheet.ciiva.com/16940/pyu-rc0402-51-rohs-l-6-16940293.pdf?src-supplier=Avnet+Europe; ComponentLink1Description: https://datasheet.ciiva.com/16940/pyu-rc0402-51-rohs-l-6-16940293.pdf?src-supplier=Avnet+Europe; ComponentLink2URL: https://datasheet.ciiva.com/28386/pyu-rc0402-51-rohs-l-6-28386855.pdf?src-supplier=Avnet+Europe; ComponentLink2Description: https://datasheet.ciiva.com/28386/pyu-rc0402-51-rohs-l-6-28386855.pdf?src-supplier=Avnet+Europe; ComponentLink3URL: https://datasheet.ciiva.com/16740/pyu-rc0402-51-rohs-l-6-r-16740602.pdf?src-supplier=Future+Electronics; ComponentLink3Description: https://datasheet.ciiva.com/16740/pyu-rc0402-51-rohs-l-6-r-16740602.pdf?src-supplier=Future+Electronics; ComponentLink4URL: https://datasheet.ciiva.com/8891/pyu-rc0402-51-rohs-l-6-8891339.pdf?src-supplier=Avnet; ComponentLink4Description: https://datasheet.ciiva.com/8891/pyu-rc0402-51-rohs-l-6-8891339.pdf?src-supplier=Avnet; ComponentLink5URL: https://datasheet.ciiva.com/5557/pyu-rc0402-51-rohs-l-6-r-5557997.pdf?src-supplier=Mouser; ComponentLink5Description: https://datasheet.ciiva.com/5557/pyu-rc0402-51-rohs-l-6-r-5557997.pdf?src-supplier=Mouser; ComponentLink6URL: https://datasheet.ciiva.com/7983/1018594-7983533.pdf?src-supplier=Element14; ComponentLink6Description: https://datasheet.ciiva.com/7983/1018594-7983533.pdf?src-supplier=Element14; Supplier 1: Newark; Manufacturer Part Number 1: RC0402FR-1310KL; Stock 1: 62239; Pricing 1: 1=0.10000, 25=0.01200, 100=0.00400, 250=0.00400, 500=0.00300, 1000=0.00300 (USD); RoHS: Yes; Case/Package: 0402; Number of Pins: 2; Contact Plating: Tin,Matte,Lead; Case Code (Imperial): 0402; Case Code (Metric): 1005; Min Operating Temperature: -55°C; Max Operating Temperature: 155°C; Tolerance: 1%; Composition: Thick Film; Packaging: Tape and Reel; Termination: SMD/SMT; Military Standard: Not; Voltage Rating (DC): 50V; Working Voltage: 50V; Number of Terminations: 2; Length: 1mm; Depth: 0.5mm; Radiation Hardening: No; REACH SVHC: No SVHC; Lead Free: Lead Free; Supplier Part Number 1: 67R9960; Supplier 2: Future Electronics; Supplier 3: Mouser; Supplier 4: Element14; Supplier Part Number 2: RC0402FR-1310KL-CUTT; Supplier Part Number 3: 603-RC0402FR-1310KL; Supplier Part Number 4: 1799235
R84 R96 = RC0402FR-072K2L: RES SMD 2.2K OHM 1% 1/16W 0402; Manufacturer 1: Yageo; Resistance: 2.2kR; Temperature Coefficient: 100ppm/°C; Power Rating: 63mW; Voltage Rating: 50V; Supplier 1: Digi-Key; Manufacturer Part Number 1: RC0402FR-072K2L; Stock 1: 12579098; Pricing 1: 1=0.10000, 10=0.01600, 100=0.00640, 1000=0.00289, 2500=0.00251, 5000=0.00207 (USD); RoHS: Yes; Case/Package: 0402; Weight: 2.3E-05oz; Case Code (Imperial): 0402; Case Code (Metric): 1005; Min Operating Temperature: -55°C; Max Operating Temperature: 155°C; Packaging: Tape and Reel; Tolerance: 1%; Composition: Thick Film; Termination: SMD/SMT; Military Standard: Not; Length: 1mm; Height: 0.35mm; Width: 0.5mm; Depth: 0.5mm; Lead Free: Lead Free; REACH SVHC: Unknown; ComponentLink1URL: https://datasheet.ciiva.com/11808/0900766b80c66297-11808786.pdf?src-supplier=RSComponents; ComponentLink1Description: https://datasheet.ciiva.com/11808/0900766b80c66297-11808786.pdf?src-supplier=RSComponents; ComponentLink2URL: https://datasheet.ciiva.com/12577/pyu-rc0402-51-rohs-l-6-r-12577429.pdf?src-supplier=Mouser; ComponentLink2Description: https://datasheet.ciiva.com/12577/pyu-rc0402-51-rohs-l-6-r-12577429.pdf?src-supplier=Mouser; ComponentLink3URL: https://datasheet.ciiva.com/16741/pyu-rc0402-51-rohs-l-6-r-16741015.pdf?src-supplier=Future+Electronics; ComponentLink3Description: https://datasheet.ciiva.com/16741/pyu-rc0402-51-rohs-l-6-r-16741015.pdf?src-supplier=Future+Electronics; ComponentLink4URL: https://datasheet.ciiva.com/7983/1018594-7983515.pdf?src-supplier=Element14; ComponentLink4Description: https://datasheet.ciiva.com/7983/1018594-7983515.pdf?src-supplier=Element14; ComponentLink5URL: https://datasheet.ciiva.com/46383/1018594-46383563.pdf?src-supplier=Element14; ComponentLink5Description: https://datasheet.ciiva.com/46383/1018594-46383563.pdf?src-supplier=Element14; ComponentLink6URL: https://datasheet.ciiva.com/7849/1018594-7849928.pdf?src-supplier=Element14; ComponentLink6Description: https://datasheet.ciiva.com/7849/1018594-7849928.pdf?src-supplier=Element14; ComponentLink7URL: https://datasheet.ciiva.com/7849/1018594-7849929.pdf?src-supplier=Element14; ComponentLink7Description: https://datasheet.ciiva.com/7849/1018594-7849929.pdf?src-supplier=Element14; Supplier 2: Mouser; Supplier 3: Newark; Supplier Part Number 1: 311-2.20KLRCT-ND; Supplier Part Number 2: 603-RC0402FR-072K2L; Supplier Part Number 3: 98K7523
TP4 TP48 TP58 = TEST_POINT
U12 = BNO085: IMU ACCEL/GYRO/MAG I2C 32BIT; Manufacturer 1: Hillcrest Laboratories; Sensor Type: Accelerometer,Gyroscope,Magnetometer; Output Type: SPI,I2C; Supplier 1: Digi-Key; Manufacturer Part Number 1: BNO085; RoHS: No; Category: Inertial Measurement Units (IMUs); Stock 1: 11593; Pricing 1: 1=11.85000, 5=10.31200, 10=9.28100, 25=8.25000, 50=7.63120, 100=6.60000, 500=6.18750, 1000=5.77500 (USD); Mount: Surface Mount; Case/Package: LGA; Min Operating Temperature: -40°C; Max Operating Temperature: 85°C; Packaging: Tape and Reel; ComponentLink1URL: https://www.hillcrestlabs.com/downloads/bno080-datasheet?src-supplier=Digi-Key; ComponentLink1Description: https://www.hillcrestlabs.com/downloads/bno080-datasheet?src-supplier=Digi-Key; ComponentLink2URL: https://www.hillcrestlabs.com/downloads/bno080-migration-guide?src-supplier=Digi-Key; ComponentLink2Description: https://www.hillcrestlabs.com/downloads/bno080-migration-guide?src-supplier=Digi-Key; Supplier Part Number 1: 1888-1006-1-ND
Y1 = ABS06-127-32.768KHZ-T: CRYSTAL 32.768kHz ±20ppm Crystal 12.5pF 90 kOhms 2-SMD, No Lead; Manufacturer 1: Abracon; ESR (Equivalent Series Resistance): 90kR; Supplier 1: Digi-Key; Manufacturer Part Number 1: ABS06-127-32.768KHZ-T; RoHS: Yes; Stock 1: 1640; Pricing 1: 1=0.69000, 10=0.60700, 50=0.56760, 100=0.50160, 500=0.47520, 1000=0.39600 (USD); Mount: Surface Mount; Case/Package: SMD/SMT; Min Operating Temperature: -40°C; Max Operating Temperature: 85°C; Packaging: Tape and Reel; ComponentLink1URL: http://www.farnell.com/datasheets/2614114.pdf?src-supplier=Farnell; ComponentLink1Description: http://www.farnell.com/datasheets/2614114.pdf?src-supplier=Farnell; ComponentLink2URL: https://abracon.com/datasheets/ABS06-127-32.768kHz-T.pdf?src-supplier=Digi-Key; ComponentLink2Description: https://abracon.com/datasheets/ABS06-127-32.768kHz-T.pdf?src-supplier=Digi-Key; ComponentLink3URL: http://www.farnell.com/datasheets/2614114.pdf?src-supplier=Newark; ComponentLink3Description: http://www.farnell.com/datasheets/2614114.pdf?src-supplier=Newark; Supplier 2: Digi-Key; Supplier 3: Mouser; Supplier 4: Verical; Supplier Part Number 1: 535-14513-1-ND; Supplier Part Number 2: 535-14513-6-ND; Supplier Part Number 3: 815-ABS0612732.768KT; Supplier Part Number 4: ABS06-127-32.768KHZ-T

## Nets that join several sheets
1V05: DM2097_IMX378 (FB3.1), DM2097_Power_Supply (6 pins)
1V8: DM2097_IMX378 (FB2.1), DM2097_BOOT_AUX_uSD (13 pins), DM2097_Power_Supply (5 pins), DM2097_IMU (9 pins)
2V8: DM2097_IMX378 (FB1.1), DM2097_Power_Supply (C42.2 U9.5)
3V3: DM2097_BOOT_AUX_uSD (5 pins), DM2097_RJ45 (D17.2 J4.15 J4.17), DM2097_Power_Supply (6 pins), DM2097_IMU (C28.2 C30.2 U12.3)
GND: DM2097_IMX378 (18 pins), DM2097_BOOT_AUX_uSD (22 pins), DM2097_RJ45 (7 pins), DM2097_Power_Supply (43 pins), DM2097_Connector_B (28 pins), DM2097_IMU (11 pins)
VDD_5V: DM2097_Power_Supply (21 pins), DM2097_Connector_B (10 pins)
BNO08x_BOOTN_1V8: DM2097_Connector_B (J21.42), DM2097_IMU (R34.1 TP4.1 U12.4)
BNO08x_RSTn_1V8: DM2097_Connector_B (J21.44), DM2097_IMU (R80.1 TP48.1 U12.11)
BNO08x_WAKE_1V8: DM2097_Connector_B (J21.52), DM2097_IMU (R36.1 TP58.1 U12.6)
BOOT0: DM2097_BOOT_AUX_uSD (R86.1 R117.2 SW1.6), DM2097_Connector_B (J21.26)
BOOT1: DM2097_BOOT_AUX_uSD (R85.1 R115.2 SW1.5), DM2097_Connector_B (J21.24)
BOOT2: DM2097_BOOT_AUX_uSD (R79.1 R114.2 SW1.4), DM2097_Connector_B (J21.22)
BOOT3: DM2097_BOOT_AUX_uSD (R78.1 R116.2 SW1.3), DM2097_Connector_B (J21.20)
BOOT4: DM2097_BOOT_AUX_uSD (R77.1 R113.2 SW1.2), DM2097_Connector_B (J21.18)
GPIO58: DM2097_BOOT_AUX_uSD (R76.1 R118.2 SW1.1), DM2097_Connector_B (J21.28)
SYS_RST: DM2097_BOOT_AUX_uSD (J22.6), DM2097_Connector_B (J21.89)
TCK: DM2097_BOOT_AUX_uSD (J22.2), DM2097_Connector_B (J21.97)
TDI: DM2097_BOOT_AUX_uSD (J22.3), DM2097_Connector_B (J21.95)
TDO: DM2097_BOOT_AUX_uSD (J22.5), DM2097_Connector_B (J21.91)
TMS: DM2097_BOOT_AUX_uSD (J22.1), DM2097_Connector_B (J21.99)
TRST: DM2097_BOOT_AUX_uSD (J22.4), DM2097_Connector_B (J21.93)

## Assembly variants
Production SERIES: not fitted C75 C76 C77 C78 C79 C80 C90 C113 C114 C115 C116 D9 D10 J6 J14 J15 J16 J17 J20 J22 J24 J26 J27 J29 R9 R16 R26 R39 R42 R44 R52 R53 R58 R63 R65 R66 R69 R70 R71 R72 R73 R77 R79 R85 R87 R97 R98 R99 R102 R103 R104 R105 R106 R107 R110 R116 R117 R118 R128 R129 R130 SW1 U6
Production SAMPLES: not fitted J6 J14 J15 J16 J17 J20 J24 J26 J27 J29 R9 R16 R26 R39 R52 R53 R63 R65 R66 R104 R105 R113 R114 R115 R116 R117 R118 R126 R127 R128 R129 R130